# Altium schematic sheet 05-High Speed MUX.SchDoc
size B; SheetNumber: 5; SheetTotal: 25
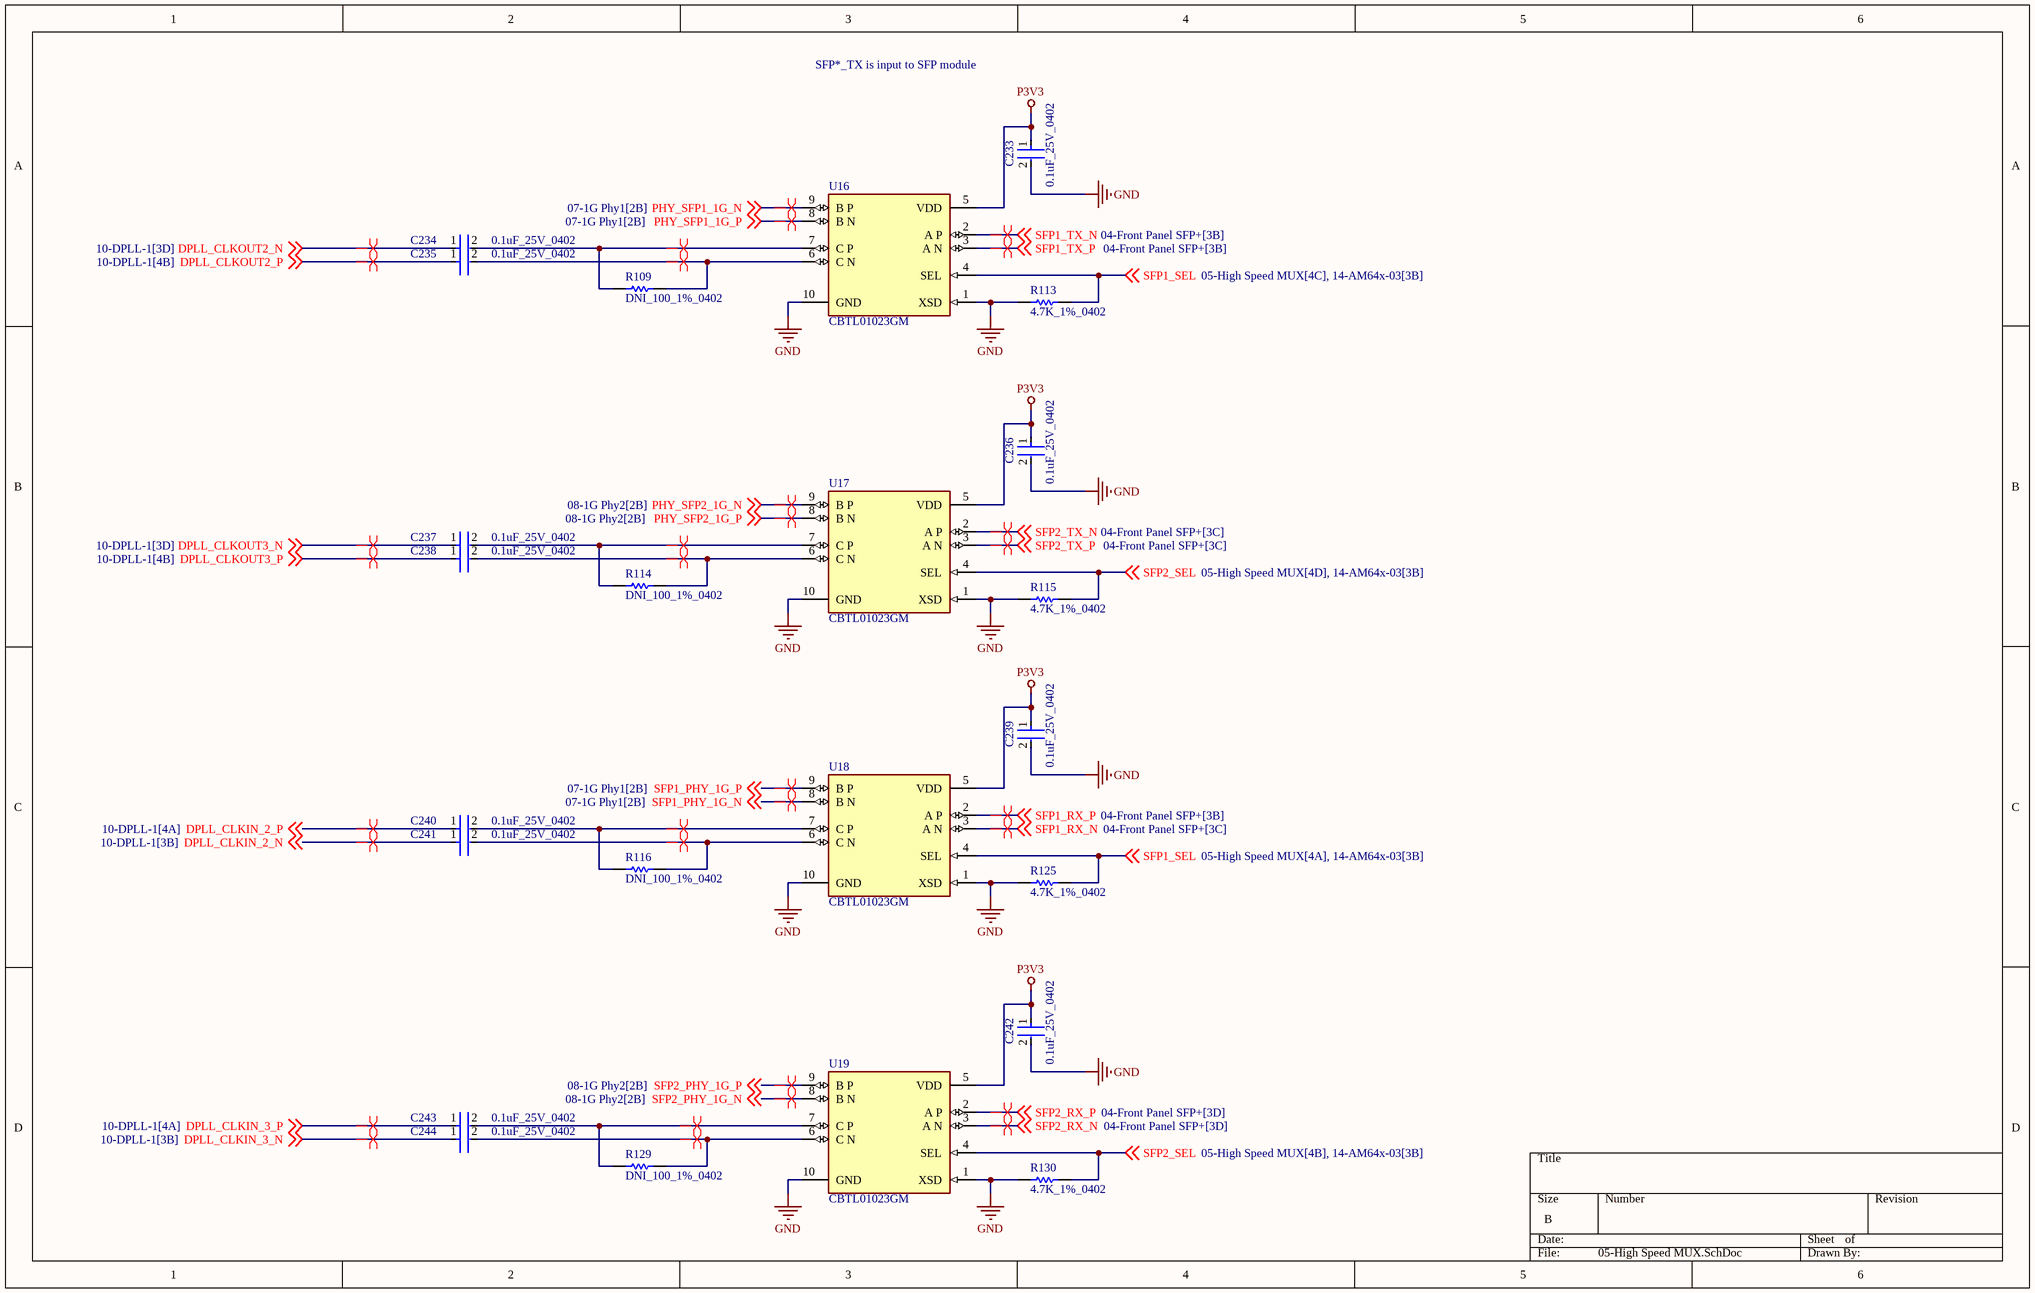
[diagram p0: 05-High Speed MUX.SchDoc]

## Parts
C233  0.1uF_25V_0402  [FP-0402-L_1_0_1-W_0_5_0_1-IPC_C]
C234  0.1uF_25V_0402  [FP-0402-L_1_0_1-W_0_5_0_1-IPC_C]
C235  0.1uF_25V_0402  [FP-0402-L_1_0_1-W_0_5_0_1-IPC_C]
C236  0.1uF_25V_0402  [FP-0402-L_1_0_1-W_0_5_0_1-IPC_C]
C237  0.1uF_25V_0402  [FP-0402-L_1_0_1-W_0_5_0_1-IPC_C]
C238  0.1uF_25V_0402  [FP-0402-L_1_0_1-W_0_5_0_1-IPC_C]
C239  0.1uF_25V_0402  [FP-0402-L_1_0_1-W_0_5_0_1-IPC_C]
C240  0.1uF_25V_0402  [FP-0402-L_1_0_1-W_0_5_0_1-IPC_C]
C241  0.1uF_25V_0402  [FP-0402-L_1_0_1-W_0_5_0_1-IPC_C]
C242  0.1uF_25V_0402  [FP-0402-L_1_0_1-W_0_5_0_1-IPC_C]
C243  0.1uF_25V_0402  [FP-0402-L_1_0_1-W_0_5_0_1-IPC_C]
C244  0.1uF_25V_0402  [FP-0402-L_1_0_1-W_0_5_0_1-IPC_C]
R109  DNI_100_1%_0402  [RESC1005X40X25LL05T10]  (no BOM)
R113  4.7K_1%_0402  [RESC1005X40X25NL10T10]
R114  DNI_100_1%_0402  [RESC1005X40X25LL05T10]  (no BOM)
R115  4.7K_1%_0402  [RESC1005X40X25NL10T10]
R116  DNI_100_1%_0402  [RESC1005X40X25LL05T10]  (no BOM)
R125  4.7K_1%_0402  [RESC1005X40X25NL10T10]
R129  DNI_100_1%_0402  [RESC1005X40X25LL05T10]  (no BOM)
R130  4.7K_1%_0402  [RESC1005X40X25NL10T10]
U16  CBTL01023GM  [FP-SOT1049-3-MFG]
U17  CBTL01023GM  [FP-SOT1049-3-MFG]
U18  CBTL01023GM  [FP-SOT1049-3-MFG]
U19  CBTL01023GM  [FP-SOT1049-3-MFG]

## Nets
GND: C233.2 C236.2 C239.2 C242.2 R113.1 R115.1 R125.1 R130.1 U16.1(XSD) U16.10(GND) U17.1(XSD) U17.10(GND) U18.1(XSD) U18.10(GND) U19.1(XSD) U19.10(GND)
P3V3: C233.1 C236.1 C239.1 C242.1 U16.5(VDD) U17.5(VDD) U18.5(VDD) U19.5(VDD)
DPLL_CLKIN_2_N: C241.1 ; off-sheet DPLL_CLKIN_2_N
DPLL_CLKIN_2_P: C240.1 ; off-sheet DPLL_CLKIN_2_P
DPLL_CLKIN_3_N: C244.1 ; off-sheet DPLL_CLKIN_3_N
DPLL_CLKIN_3_P: C243.1 ; off-sheet DPLL_CLKIN_3_P
DPLL_CLKOUT2_N: C234.1 ; off-sheet DPLL_CLKOUT2_N
DPLL_CLKOUT2_P: C235.1 ; off-sheet DPLL_CLKOUT2_P
DPLL_CLKOUT3_N: C237.1 ; off-sheet DPLL_CLKOUT3_N
DPLL_CLKOUT3_P: C238.1 ; off-sheet DPLL_CLKOUT3_P
PHY_SFP1_1G_N: U16.9(B_P) ; off-sheet PHY_SFP1_1G_N
PHY_SFP1_1G_P: U16.8(B_N) ; off-sheet PHY_SFP1_1G_P
PHY_SFP2_1G_N: U17.9(B_P) ; off-sheet PHY_SFP2_1G_N
PHY_SFP2_1G_P: U17.8(B_N) ; off-sheet PHY_SFP2_1G_P
SFP1_PHY_1G_N: U18.8(B_N) ; off-sheet SFP1_PHY_1G_N
SFP1_PHY_1G_P: U18.9(B_P) ; off-sheet SFP1_PHY_1G_P
SFP1_RX_N: U18.3(A_N) ; off-sheet SFP1_RX_N
SFP1_RX_P: U18.2(A_P) ; off-sheet SFP1_RX_P
SFP1_SEL: R113.2 R125.2 U16.4(SEL) U18.4(SEL) ; off-sheet SFP1_SEL
SFP1_TX_N: U16.2(A_P) ; off-sheet SFP1_TX_N
SFP1_TX_P: U16.3(A_N) ; off-sheet SFP1_TX_P
SFP2_PHY_1G_N: U19.8(B_N) ; off-sheet SFP2_PHY_1G_N
SFP2_PHY_1G_P: U19.9(B_P) ; off-sheet SFP2_PHY_1G_P
SFP2_RX_N: U19.3(A_N) ; off-sheet SFP2_RX_N
SFP2_RX_P: U19.2(A_P) ; off-sheet SFP2_RX_P
SFP2_SEL: R115.2 R130.2 U17.4(SEL) U19.4(SEL) ; off-sheet SFP2_SEL
SFP2_TX_N: U17.2(A_P) ; off-sheet SFP2_TX_N
SFP2_TX_P: U17.3(A_N) ; off-sheet SFP2_TX_P
NetC234_2: C234.2 R109.1 U16.7(C_P)
NetC235_2: C235.2 R109.2 U16.6(C_N)
NetC237_2: C237.2 R114.1 U17.7(C_P)
NetC238_2: C238.2 R114.2 U17.6(C_N)
NetC240_2: C240.2 R116.1 U18.7(C_P)
NetC241_2: C241.2 R116.2 U18.6(C_N)
NetC243_2: C243.2 R129.1 U19.7(C_P)
NetC244_2: C244.2 R129.2 U19.6(C_N)

## Layout directives
differential pair: DPLL_CLKIN_2_N, DPLL_CLKIN_2_P, DPLL_CLKIN_3_N, DPLL_CLKIN_3_P, DPLL_CLKOUT2_N, DPLL_CLKOUT2_P, DPLL_CLKOUT3_N, DPLL_CLKOUT3_P, NetC234_2, NetC235_2, NetC237_2, NetC238_2, NetC240_2, NetC241_2, NetC243_2, NetC244_2, PHY_SFP1_1G_N, PHY_SFP1_1G_P, PHY_SFP2_1G_N, PHY_SFP2_1G_P, SFP1_PHY_1G_N, SFP1_PHY_1G_P, SFP1_RX_N, SFP1_RX_P, SFP1_TX_N, SFP1_TX_P, SFP2_PHY_1G_N, SFP2_PHY_1G_P, SFP2_RX_N, SFP2_RX_P, SFP2_TX_N, SFP2_TX_P

## Notes on the sheet
- SFP*_TX is input to SFP module

## Library data of the parts
C233-C244 = CMP-2008-02519-2: General Purpose Ceramic Capacitor, 0402, 100nF, 10%, X7R, 15%, 25V; Package Quantity: 1; Capacitance: 100nF; Min Operating Temperature: -55°C; Voltage: 25V; Voltage Rating: 25V; Construction: Flat; Max Operating Temperature: 125°C; Radiation Hardening: No; Depth: 0.5mm; Thickness: 0.022inch; Voltage Rating (DC): 25V; Number of Pins: 2; Lead Free: Lead Free; Series: -; REACH SVHC: No SVHC; Length: 1mm; Dielectric: X7R; RoHS Compliant: Yes; Mount: Surface Mount; Packaging: Tape and Reel; Case/Package: 0402; Case Code (Imperial): 0402; Termination: SMD/SMT; Width: 0.02inch; Case Code (Metric): 1005; Tolerance: 10%
R109 R114 R116 R129 = CMP-2002-03042-1: Manufacturer: Vishay Dale; Part Number: CRCW0402100RFKEDHP
R113 R115 R125 R130 = CMP-2002-05217-1: Manufacturer: Bourns; Part Number: CR0402-FX-4701GLF
U16-U19 = CMP-10118-000007-1: DisplayPort, PCIe, USB Switch IC 1 Channel 10-XQFN (1.55x2); RoHS Compliant: Yes